# EAGLE design ledpenv5 (EAGLE 5.06)
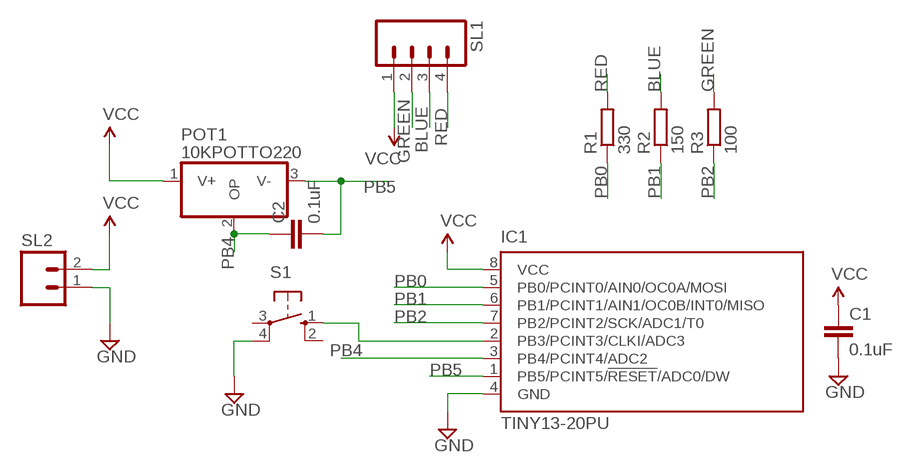
[diagram p0: schematic, sheet 1]

## Parts
C1  0.1uF  C-EUC1206  [C1206]
C2  0.1uF  C-EUC1206  [C1206]
IC1  TINY13-20PU  [DIL08]
POT1  10KPOTTO220  [TO220V]
R1  330  R-EU_R1206  [R1206]
R2  150  R-EU_R1206  [R1206]
R3  100  R-EU_R1206  [R1206]
S1  10-XX  [B3F-10XX]
SL1  M04  [04P]
SL2  M02  [02P]

## Nets
BLUE: R2.2 SL1.3
GND: C1.2 IC1.4(GND) S1.4(P1) SL2.1
GREEN: R3.2 SL1.2
N$8: IC1.2(PB3/PCINT3/CLKI/ADC3) S1.1(S)
PB0: IC1.5(PB0/PCINT0/AIN0/OC0A/MOSI) R1.1
PB1: IC1.6(PB1/PCINT1/AIN1/OC0B/INT0/MISO) R2.1
PB2: IC1.7(PB2/PCINT2/SCK/ADC1/T0) R3.1
PB4: C2.1 IC1.3(PB4/PCINT4/ADC2) POT1.2(OP)
PB5: C2.2 IC1.1(PB5/PCINT5/!RESET!/ADC0/DW) POT1.3(V-)
RED: R1.2 SL1.4
VCC: C1.1 IC1.8(VCC) POT1.1(V+) SL1.1 SL2.2
Unconnected: S1.2(S1) S1.3(P)

## Library data of the parts
C1 C2 = rcl:C-EU: CAPACITOR, European symbol
IC1 = atmel:TINY13: 8-bit AVR Microcontroller with 1K Bytes In-System Programmable Flash Source: http://www.atmel.com/dyn/resources/prod_documents/2535S.pdf
POT1 = nehul:10KPOT
R1-R3 = rcl:R-EU_: RESISTOR, European symbol
S1 = switch-omron:10-XX: OMRON SWITCH
SL1 = con-amp-quick:M04: AMP QUICK CONNECTOR
SL2 = con-amp-quick:M02: AMP QUICK CONNECTOR

## Board
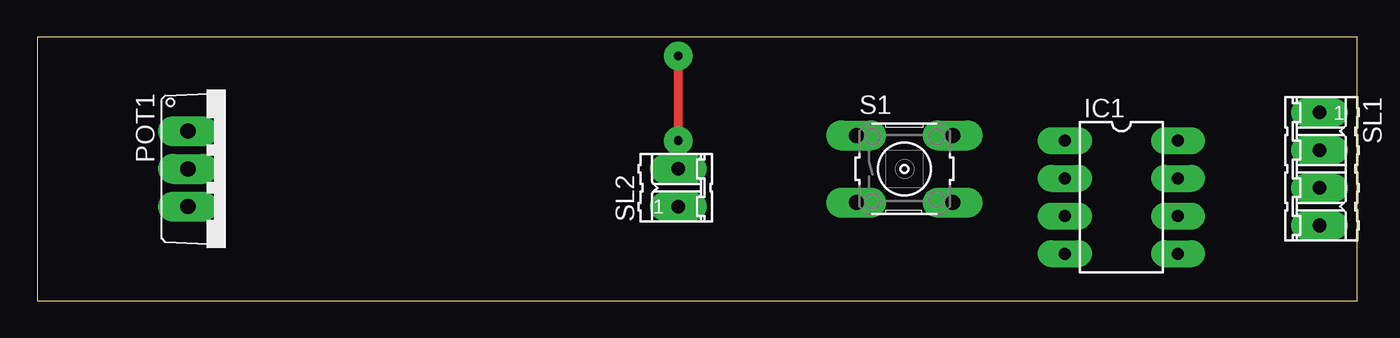
[diagram p1: board, top side]
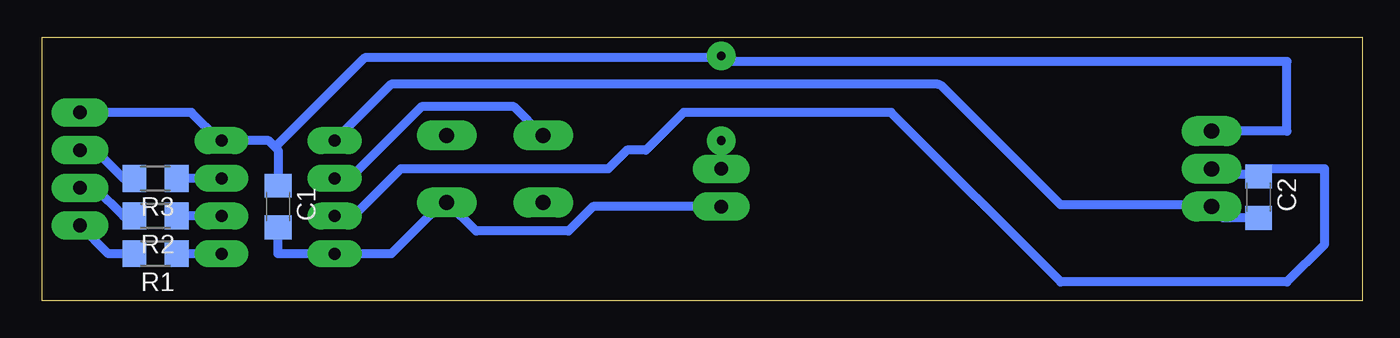
[diagram p2: board, bottom side, seen from below]

Size 88.9 x 17.78 mm. Coordinates in mm from the lower left corner, seen from the top.
Outline: 0,0 88.9,0 88.9,17.78 0,17.78 0,0
Copper layers (1*16): Top 0.035mm / dielectric 1.5mm / Bottom 0.035mm
Design rules "default *": minimum track width 24mil, minimum drill 24mil, track to track 20mil, track to pad 20mil, pad to pad 20mil, via to via 20mil, smd to smd 20mil, copper to edge 40mil, drill to drill 8mil, minimum pad ring 20mil, minimum via ring 20mil, stop-mask expansion 4mil, vias tented up to drill 0mil, thermal gap 10mil

### Footprints (pad centres in the part's own frame; a part is rotated, then mirrored left to right if it is on the bottom)
C1206 = smd 1.6 x 1.8: 1 -1.4,0; 2 1.4,0
DIL08 = drill 0.813 long: 1 -3.81,-3.81; 2 -1.27,-3.81; 3 1.27,-3.81; 4 3.81,-3.81; 5 3.81,3.81; 6 1.27,3.81; 7 -1.27,3.81; 8 -3.81,3.81
TO220V = drill 1.016 long: 1 -2.54,-2.54; 2 0,-2.54; 3 2.54,-2.54
R1206 = smd 1.6 x 1.803: 1 -1.422,0; 2 1.422,0
B3F-10XX = drill 1.016 long: 1 -3.251,2.261; 2 3.251,2.261; 3 -3.251,-2.261; 4 3.251,-2.261
04P = drill 0.914 long: 1 -3.81,0; 2 -1.27,0; 3 1.27,0; 4 3.81,0
02P = drill 0.914 long: 1 -1.27,0; 2 1.27,0

### Placement (x,y rotation side)
C1  73.03,6.35 270 bottom
C2  6.99,6.99 270 bottom
IC1  73.03,6.99 270 top
POT1  12.7,8.89 270 top
R1  81.28,3.17 180 bottom
R2  81.28,5.71 180 bottom
R3  81.28,8.26 180 bottom
S1  58.42,8.89 0 top
SL1  86.36,8.89 270 top
SL2  43.18,7.62 90 top

### Tracks (layer width: path | path; a pad name or v marks a point on that pad's centre or on a via)
BLUE
  Bottom 0.61: SL1.3 85.34,7.62 83.44,5.71 R2.2
GND
  Bottom 0.61: C1.2 73.03,3.17 IC1.4 | IC1.4 68.96,3.05 | SL2.1 51.82,6.35 53.47,4.7 59.69,4.7 61.59,6.6 S1.4 61.98,6.6 65.41,3.17 IC1.4
GREEN
  Bottom 0.61: SL1.2 85.34,10.16 83.44,8.26 R3.2
N$8
  Bottom 0.61: IC1.2 68.2,8.26 63.37,13.08 57.15,13.08 55.24,11.18 S1.1
PB0
  Bottom 0.61: IC1.5 R1.1
PB1
  Bottom 0.61: IC1.6 R2.1
PB2
  Bottom 0.61: IC1.7 R3.1
PB4
  Bottom 0.61: IC1.3 67.94,5.71 64.77,8.89 50.8,8.89 49.53,10.16 48.26,10.16 45.72,12.7 31.75,12.7 20.32,1.27 5.08,1.27 2.54,3.81 2.54,8.89 6.48,8.89 C2.1 6.99,8.51 9.78,8.51 POT1.2 10.41,8.76
PB5
  Bottom 0.61: C2.2 9.4,5.59 POT1.3 10.41,6.48 20.32,6.48 28.32,14.48 28.57,14.61 65.41,14.61 IC1.1
RED
  Bottom 0.61: SL1.4 84.45,3.17 R1.2
VCC  (via drill 0.6 pad 1.93)
  Top 0.61: v43.18,16.51 v43.18,10.79
  Bottom 0.61: C1.1 73.03,10.16 73.22,10.35 | 73.22,10.35 73.66,10.79 IC1.8 77.09,10.92 78.87,12.7 SL1.1 | v43.18,10.79 SL2.2 | v43.18,16.51 42.93,16.38 | v43.18,16.51 42.67,16.26 | v43.18,16.51 43.43,16.38 67.18,16.38 73.22,10.35 | v43.18,16.51 42.42,16.13 5.08,16.13 5.08,11.43 POT1.1